# EAGLE schematic BLL-EBOOK (EAGLE 9.6.2)
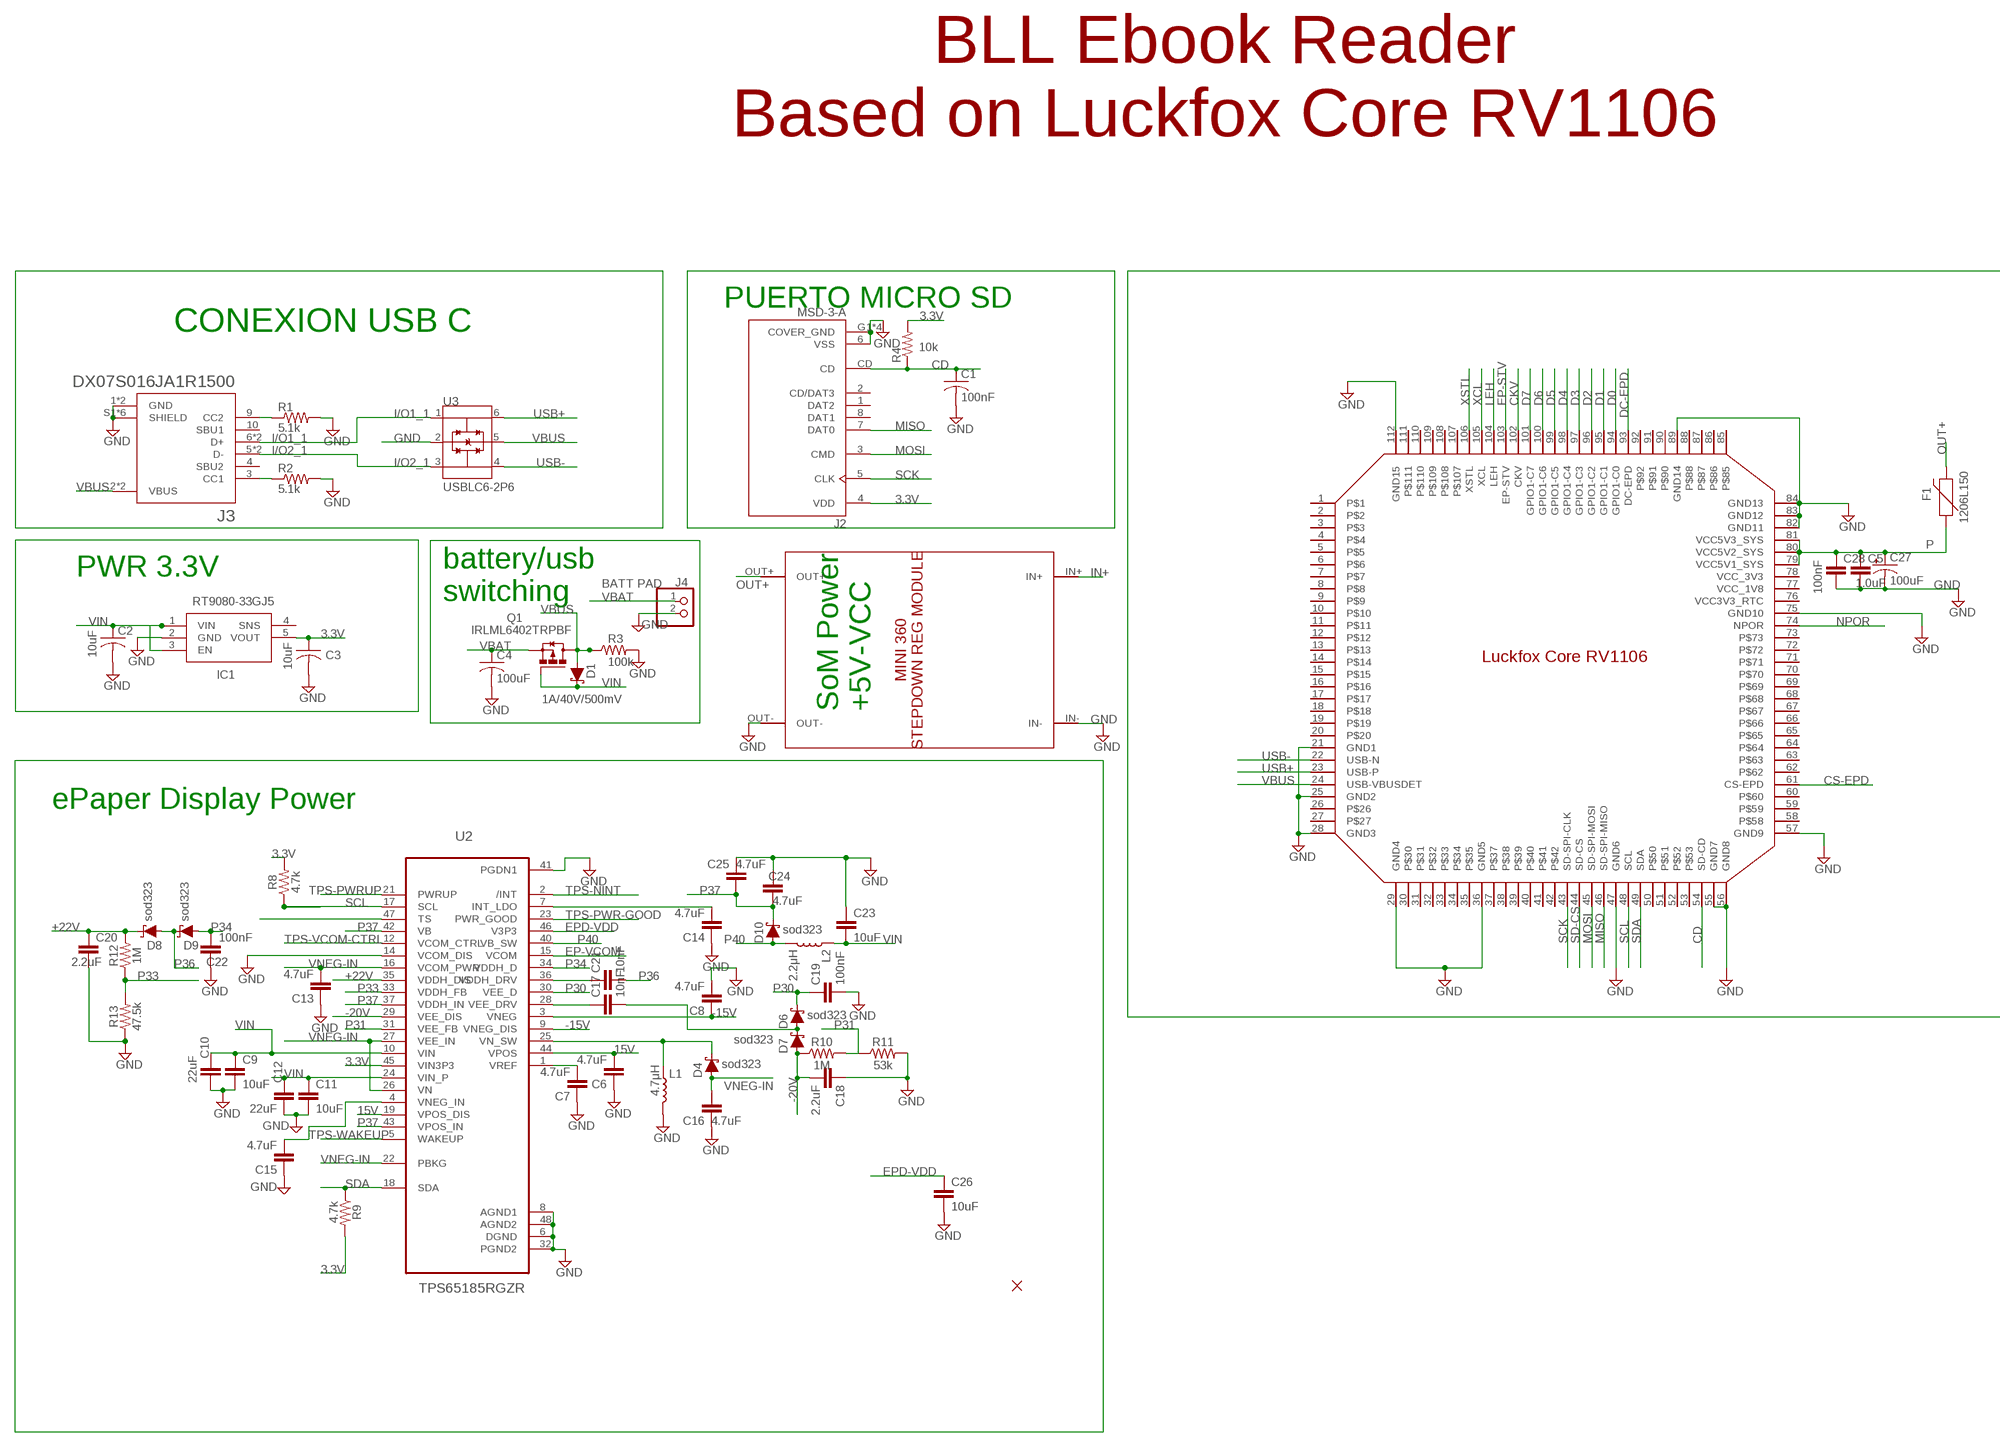
[diagram p0: schematic, sheet 1, part 1 of 2]
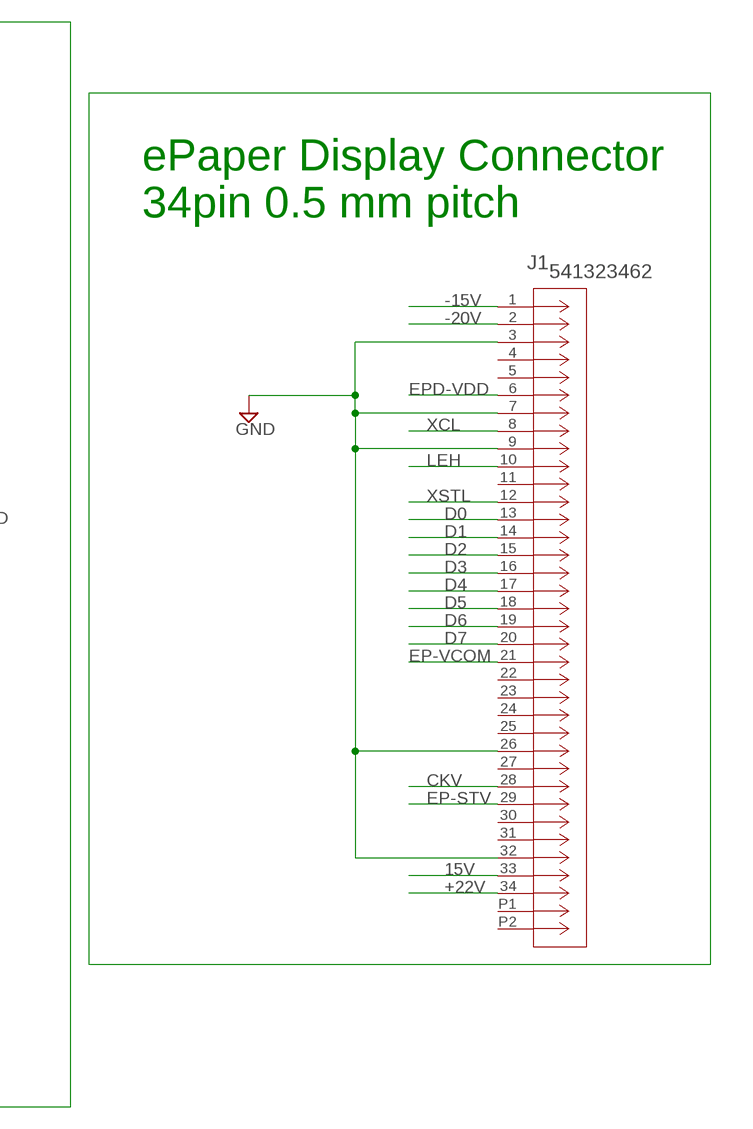
[diagram p1: schematic, sheet 1, part 2 of 2]

## Parts
C1  100nF  C-USC0603  [C0603]
C2  10uF  C-USC0603  [C0603]
C3  10uF  C-USC0603  [C0603]
C4  100uF  C-USC0603  [C0603]
C5  1.0uF  1.0UF-0603-16V-10%-X7R  [0603]
C6  4.7uF  4.7UF-0603-35V-(20%)  [0603]
C7  4.7uF  4.7UF-0603-35V-(20%)  [0603]
C8  4.7uF  4.7UF-0603-35V-(20%)  [0603]
C9  10uF  10UF-0805-10V-10%  [0805]
C10  22uF  22UF-0805-16V-20%  [0805]
C11  10uF  10UF-0805-10V-10%  [0805]
C12  22uF  22UF-0805-16V-20%  [0805]
C13  4.7uF  4.7UF-0603-35V-(20%)  [0603]
C14  4.7uF  4.7UF-0603-35V-(20%)  [0603]
C15  4.7uF  4.7UF-0603-35V-(20%)  [0603]
C16  4.7uF  4.7UF-0603-35V-(20%)  [0603]
C17  10nF  10NF-0603-50V-10%  [0603]
C18  2.2uF  2.2UF-1206-50V-10%  [1206]
C19  100nF  DNP-0603  [0603]
C20  2.2uF  2.2UF-1206-50V-10%  [1206]
C21  10nF  10NF-0603-50V-10%  [0603]
C22  100nF  DNP-0603  [0603]
C23  10uF  10UF-0805-10V-10%  [0805]
C24  4.7uF  4.7UF-0603-35V-(20%)  [0603]
C25  4.7uF  4.7UF-0603-35V-(20%)  [0603]
C26  10uF  10UF-0805-10V-10%  [0805]
C27  100uF  100UF-POLAR-EIA3528-10V-20%(TANT)  [EIA3528]
C28  100nF  CAP-0805  [0805]
D1  1A/40V/500mV  DIODE-SCHOTTKY-SS14  [SMA-DIODE]
D4  sod323  DIODE-SCHOTTKY-PMEG4005EJ  [SOD-323]
D6  sod323  DIODE-SCHOTTKY-PMEG4005EJ  [SOD-323]
D7  sod323  DIODE-SCHOTTKY-PMEG4005EJ  [SOD-323]
D8  sod323  DIODE-SCHOTTKY-PMEG4005EJ  [SOD-323]
D9  sod323  DIODE-SCHOTTKY-PMEG4005EJ  [SOD-323]
D10  sod323  DIODE-SCHOTTKY-PMEG4005EJ  [SOD-323]
F1  1206L150  PPTC_6V500MA-2  [1206]
IC1  RT9080-33GJ5  [SOT94P280X100-5N]
J1  541323462  [CON_541323462_MOL]
J2  MSD-3-A  [CUI_MSD-3-A]
J3  DX07S016JA1R1500  [JAE_DX07S016JA1R1500]
J4  BATT PAD  PINHD-1X2/90  [1X02/90]
L1  4.7μH  4.7μH_SHIELDED_INDUCTOR  [1008(2520)]
L2  2.2μH  2.2μH_SHIELDED_INDUCTOR  [0806]
Q1  IRLML6402TRPBF  [SOT23]
R1  5.1k  R-US_M0805  [M0805]
R2  5.1k  R-US_M0805  [M0805]
R3  100k  R-US_R0603  [R0603]
R4  10k  R-US_M0805  [M0805]
R8  4.7k  4.7KOHM-0603-1/10W-1%  [0603]
R9  4.7k  4.7KOHM-0603-1/10W-1%  [0603]
R10  1M  1MOHM-0603-1/4W-5%  [0603]
R11  53k  RESISTOR0805  [0805]
R12  1M  1MOHM-0603-1/4W-5%  [0603]
R13  47.5k  RESISTOR0805  [0805]
U2  TPS65185RGZR  [QFN50P700X700X100-49N]
U3  USBLC6-2P6  [SOT50P160X60-6N]
U$1  LUCKFOX_CORE_RV1106  [CORE1106-SMT]
U$2  MINI360-MOD-REG  [MINI360]

## Nets
3.3V: C3.1 IC1.5(VOUT) J2.4(VDD) R4.2 R8.2 R9.2 U2.45(VIN3P3)
15V: C6.2 J1.33 U2.19(VPOS_DIS) U2.44(VPOS)
+22V: C20.1 D8.C J1.34 R12.2 U2.35(VDDH_DIS)
-15V: C8.1 J1.1 U2.3(VNEG) U2.9(VNEG_DIS)
-20V: C18.2 D7.A J1.2 R10.1 U2.29(VEE_DIS)
CD: C1.1 J2.CD R4.1 U$1.54(SD-CD)
CKV: J1.28 U$1.102(CKV)
CS-EPD: U$1.61(CS-EPD)
D0: J1.13 U$1.94(GPIO1-C0)
D1: J1.14 U$1.95(GPIO1-C1)
D2: J1.15 U$1.96(GPIO1-C2)
D3: J1.16 U$1.97(GPIO1-C3)
D4: J1.17 U$1.98(GPIO1-C4)
D5: J1.18 U$1.99(GPIO1-C5)
D6: J1.19 U$1.100(GPIO1-C6)
D7: J1.20 U$1.101(GPIO1-C7)
DC-EPD: U$1.93(DC-EPD)
EP-STV: J1.29 U$1.103(EP-STV)
EP-VCOM: J1.21 U2.15(VCOM)
EPD-VDD: C26.1 J1.6 U2.46(V3P3)
GND: C1.2 C2.2 C3.2 C4.2 C5.2 C6.1 C7.1 C8.2 C9.2 C10.2 C11.2 C12.2 C13.1 C14.1 C15.1 C16.1 C18.1 C19.2 C20.2 C22.1 C23.1 C24.2 C25.2 C26.2 C27.C(-) C28.2 IC1.2(GND) J1.3 J1.7 J1.9 J1.26 J1.32 J2.6(VSS) J2.G1(COVER_GND) J2.G2(COVER_GND) J2.G3(COVER_GND) J2.G4(COVER_GND) J3.1(GND) J3.12(GND) J3.S1(SHIELD) J3.S2(SHIELD) J3.S3(SHIELD) J3.S4(SHIELD) J3.S5(SHIELD) J3.S6(SHIELD) J4.2 L1.2 R1.2 R2.2 R3.2 R11.2 R13.1 U2.6(DGND) U2.8(AGND1) U2.14(VCOM_DIS) U2.32(PGND2) U2.41(PGDN1) U2.48(AGND2) U3.2(GND) U$1.21(GND1) U$1.25(GND2) U$1.28(GND3) U$1.29(GND4) U$1.36(GND5) U$1.47(GND6) U$1.55(GND7) U$1.56(GND8) U$1.57(GND9) U$1.75(GND10) U$1.82(GND11) U$1.83(GND12) U$1.84(GND13) U$1.89(GND14) U$1.112(GND15) U$2.IN- U$2.OUT-
I/O1_1: J3.6(D+) J3.7(D+) U3.1(I/O1_1)
I/O2_1: J3.5(D-) J3.8(D-) U3.3(I/O2_1)
IN+: U$2.IN+
LEH: J1.10 U$1.104(LEH)
MISO: J2.7(DAT0) U$1.46(SD-SPI-MISO)
MOSI: J2.3(CMD) U$1.45(SD-SPI-MOSI)
N$3: J3.3(CC1) R2.1
N$4: J3.9(CC2) R1.1
N$11: U2.47(TS)
N$12: C7.2 U2.1(VREF)
N$13: C15.2 U2.4(VNEG_IN)
N$14: C14.2 U2.7(INT_LDO)
N$15: D4.C L1.1 U2.25(VN_SW)
N$16: C17.1 U2.28(VEE_DRV)
N$17: C17.2 D6.A D7.C
N$19: C21.1 U2.36(VDDH_DRV)
NPOR: U$1.74(NPOR)
OUT+: F1.2 U$2.OUT+
P: C5.1 C27.A(+) C28.1 F1.1 U$1.79(VCC5V1_SYS) U$1.80(VCC5V2_SYS) U$1.81(VCC5V3_SYS)
P30: C19.1 D6.C U2.30(VEE_D)
P31: R10.2 R11.1 U2.31(VEE_FB)
P33: R12.1 R13.2 U2.33(VDDH_FB)
P34: C22.2 D9.A U2.34(VDDH_D)
P36: C21.2 D8.A D9.C
P37: C24.1 C25.1 D10.C U2.37(VDDH_IN) U2.42(VB) U2.43(VPOS_IN)
P40: D10.A L2.2 U2.40(VB_SW)
SCK: J2.5(CLK) U$1.43(SD-SPI-CLK)
SCL: R8.1 U2.17(SCL) U$1.48(SCL)
SD-CS: U$1.44(SD-CS)
SDA: R9.1 U2.18(SDA) U$1.49(SDA)
TPS-NINT: U2.2(/INT)
TPS-PWR-GOOD: U2.23(PWR_GOOD)
TPS-PWRUP: U2.21(PWRUP)
TPS-VCOM-CTRL: U2.12(VCOM_CTRL)
TPS-WAKEUP: U2.5(WAKEUP)
USB+: U3.6(I/O1_2) U$1.23(USB-P)
USB-: U3.4(I/O2_2) U$1.22(USB-N)
VBAT: C4.1 J4.1 Q1.2(S)
VBUS: D1.A J3.2(VBUS) J3.11(VBUS) Q1.3(D) R3.1 U3.5(VBUS) U$1.24(USB-VBUSDET)
VIN: C2.1 C9.1 C10.1 C11.1 C12.1 C23.2 D1.C IC1.1(VIN) IC1.3(EN) L2.1 Q1.1(G) U2.10(VIN) U2.24(VIN_P)
VNEG-IN: C13.2 C16.2 D4.A U2.16(VCOM_PWR) U2.22(PBKG) U2.26(VN) U2.27(VEE_IN)
XCL: J1.8 U$1.105(XCL)
XSTL: J1.12 U$1.106(XSTL)
Unconnected: IC1.4(SNS) J1.4 J1.5 J1.11 J1.22 J1.23 J1.24 J1.25 J1.27 J1.30 J1.31 J1.P1 J1.P2 J2.1(DAT2) J2.2(CD/DAT3) J2.8(DAT1) J3.4(SBU2) J3.10(SBU1) U$1.1 U$1.2 U$1.3 U$1.4 U$1.5 U$1.6 U$1.7 U$1.8 U$1.9 U$1.10 U$1.11 U$1.12 U$1.13 U$1.14 U$1.15 U$1.16 U$1.17 U$1.18 U$1.19 U$1.20 U$1.26 U$1.27 U$1.30 U$1.31 U$1.32 U$1.33 U$1.34 U$1.35 U$1.37 U$1.38 U$1.39 U$1.40 U$1.41 U$1.42 U$1.50 U$1.51 U$1.52 U$1.53 U$1.58 U$1.59 U$1.60 U$1.62 U$1.63 U$1.64 U$1.65 U$1.66 U$1.67 U$1.68 U$1.69 U$1.70 U$1.71 U$1.72 U$1.73 U$1.77(VCC_1V8) U$1.78(VCC_3V3) U$1.85 U$1.86 U$1.87 U$1.88 U$1.90 U$1.91 U$1.92 U$1.107 U$1.108 U$1.109 U$1.110 U$1.111

## Notes on the sheet
- BLL Ebook Reader
  Based on Luckfox Core RV1106
- PUERTO MICRO SD
- CONEXION USB C
- ePaper Display Connector
  34pin 0.5 mm pitch
- PWR 3.3V
- battery/usb 
  switching
- SoM Power
  +5V-VCC
- ePaper Display Power

## Power pins joined to a net without a drawn wire
VCC3V3_RTC: U$1.76(VCC3V3_RTC)

## Library data of the parts
C1-C4 = rcl:C-US: CAPACITOR, American symbol; SPICEPREFIX: C
C5 = SparkFun-Capacitors:1.0UF: 1µF ceramic capacitors A capacitor is a passive two-terminal electrical component used to store electrical energy temporarily in an electric field.; PROD_ID: CAP-13930
C6-C8 C13-C16 C24 C25 = SparkFun-Capacitors:4.7UF: 4.7µF ceramic capacitors A capacitor is a passive two-terminal electrical component used to store electrical energy temporarily in an electric field.; PROD_ID: CAP-14106
C9 C11 C23 C26 = SparkFun-Capacitors:10UF: 10.0µF ceramic capacitors A capacitor is a passive two-terminal electrical component used to store electrical energy temporarily in an electric field.; PROD_ID: CAP-11330
C10 C12 = SparkFun-Capacitors:22UF: 22µF ceramic capacitors A capacitor is a passive two-terminal electrical component used to store electrical energy temporarily in an electric field.; PROD_ID: CAP-14260
C17 C21 = SparkFun-Capacitors:10NF: 0.01uF/10nF/10,000pF ceramic capacitors A capacitor is a passive two-terminal electrical component used to store electrical energy temporarily in an electric field. CAP-09321; PROD_ID: CAP-00867
C18 C20 = SparkFun-Capacitors:2.2UF: 2.2µF ceramic capacitors A capacitor is a passive two-terminal electrical component used to store electrical energy temporarily in an electric field.; PROD_ID: CAP-10009
C19 C22 = SparkFun-Capacitors:DNP: Do-Not-Populate capacitor; VALUE: DNP
C27 = SparkFun-Capacitors:100UF-POLAR: 100µF polarized capacitors A capacitor is a passive two-terminal electrical component used to store electrical energy temporarily in an electric field.; PROD_ID: CAP-16823
C28 = SparkFun-Capacitors:CAP
D1 = SparkFun-DiscreteSemi:DIODE-SCHOTTKY: Schottky diode A Schottky diode is a semiconductor diode which has a low forward voltage drop and a very fast switching action.; PROD_ID: DIO-08053
D4 D6-D10 = SparkFun-DiscreteSemi:DIODE-SCHOTTKY: Schottky diode A Schottky diode is a semiconductor diode which has a low forward voltage drop and a very fast switching action.; PROD_ID: DIO-10955; VALUE: 0.5A/40V/420mV
F1 = SparkFun-Fuses:PPTC: Resettable Fuse PPTC Resettable Fuse. Really a sort of resistor with a polymeric positive temperature coefficient whose resistance increases dramatically with an increase in temperature. When heated by the power passing through the resistance rises causing the current to be limited, protecting the circuit. This is achieved by the transition of the polymer from a crystalline to an amorphous state where the conductive carbon separates breaking the conductive pathways found in the cool crystalline structure. When a PPTC cools back down it resumes conducting letting the circuit turn back on. SparkFun Products: SparkFun RedBoard - Programmed with Arduino <https://www.sparkfun.com/products/12757> Pro Micro - 5V/16MHz <https://www.sparkfun.com/products/12640> Arduino Pro 328 - 5V/16MHz <https://www.sparkfun.com/products/10915> MP3 Trigger <https://www.sparkfun.com/products/13720>; PROD_ID: RES-08585; VALUE: 6V/0.5A
IC1 = RT9080-33GJ5:RT9080-33GJ5: Check availability <https://pricing.snapeda.com/parts/RT9080-33GJ5/Richtek%20USA/view-part?ref=eda>; AVAILABILITY: In Stock; CHECK_PRICES: https://www.snapeda.com/parts/RT9080-33GJ5/Richtek/view-part/?ref=eda; DESCRIPTION: Linear Voltage Regulator IC Positive Fixed 1 Output 600mA TSOT-23-5; MF: Richtek USA; MP: RT9080-33GJ5; PACKAGE: TSOT-23 Richtek; PRICE: None; SNAPEDA_LINK: https://www.snapeda.com/parts/RT9080-33GJ5/Richtek/view-part/?ref=snap
J1 = molex fpc 34p 0.5mm :541323462: Check availability <https://pricing.snapeda.com/parts/541323462/Molex/view-part?ref=eda>; AVAILABILITY: In Stock; CHECK_PRICES: https://www.snapeda.com/parts/541323462/Molex/view-part/?ref=eda; DESCRIPTION: 34 Position FFC, FPC Connector Contacts, Bottom 0.020 (0.50mm) Surface Mount, Right Angle; MF: Molex; MP: 541323462; PACKAGE: None; PRICE: None; SNAPEDA_LINK: https://www.snapeda.com/parts/541323462/Molex/view-part/?ref=snap
J2 = MSD-3-A:MSD-3-A: Check availability <https://pricing.snapeda.com/parts/MSD-3-A/Same%20Sky/view-part?ref=eda>; AVAILABILITY: In Stock; CHECK_PRICES: https://www.snapeda.com/parts/MSD-3-A/Same+Sky/view-part/?ref=eda; DESCRIPTION: Micro SD Card Connector, 9 Positions, Connector and Ejector, Push In, Auto Eject Out, Surface Mount, 0.95 mm Height Above Board, Gold Flash; MF: Same Sky; MP: MSD-3-A; PACKAGE: None; PRICE: None; SNAPEDA_LINK: https://www.snapeda.com/parts/MSD-3-A/Same+Sky/view-part/?ref=snap
J3 = DX07S016JA1R1500- usb c:DX07S016JA1R1500: Check availability <https://pricing.snapeda.com/parts/DX07S016JA1R1500/JAE%20Electronics/view-part?ref=eda>; AVAILABILITY: In Stock; CHECK_PRICES: https://www.snapeda.com/parts/DX07S016JA1R1500/JAE+Electronics/view-part/?ref=eda; DESCRIPTION: USB-C (USB TYPE-C) USB 2.0 Receptacle Connector 24 (16+8 Dummy) Position Surface Mount, Right Angle; Through Hole; MF: JAE Electronics; MP: DX07S016JA1R1500; PACKAGE: None; PRICE: None; SNAPEDA_LINK: https://www.snapeda.com/parts/DX07S016JA1R1500/JAE+Electronics/view-part/?ref=snap
J4 = pinhead:PINHD-1X2: PIN HEADER
L1 = SparkFun-Coils:4.7μH_SHIELDED_INDUCTOR: 4.7uH Inductor 4.7uH 1.4A 50mOhm 1008(2520) Package Shielded; PROD_ID: NDUC-14880
L2 = SparkFun-Coils:2.2μH_SHIELDED_INDUCTOR: Murata 2.2uH Inductor 2.2uH 1.2A 110mOhm 0806 Package Shielded Bourns 2.2uH Inductor 2.2uH 5.5A 205mOhm 5x5mm Package Shielded; PROD_ID: NDUC-14257
Q1 = IRLML6402:IRLML6402: Check availability <https://pricing.snapeda.com/parts/IRLML6402/Infineon%20Technologies/view-part?ref=eda>; AVAILABILITY: In Stock; CHECK_PRICES: https://www.snapeda.com/parts/IRLML6402/Infineon/view-part/?ref=eda; DESCRIPTION: P-Channel 20 V 3.7A (Ta) 1.3W (Ta) Surface Mount Micro3â„¢ /SOT-23; MF: Infineon Technologies; MP: IRLML6402; PACKAGE: SOT-23-3 ON Semiconductor; PRICE: None; SNAPEDA_LINK: https://www.snapeda.com/parts/IRLML6402/Infineon/view-part/?ref=snap
R1-R4 = rcl:R-US_: RESISTOR, American symbol; SPICEPREFIX: R
R8 R9 = SparkFun-Resistors:4.7KOHM: 4.7kΩ resistor A resistor is a passive two-terminal electrical component that implements electrical resistance as a circuit element. Resistors act to reduce current flow, and, at the same time, act to lower voltage levels within circuits. - Wikipedia; PROD_ID: RES-07857
R10 R12 = SparkFun-Resistors:1MOHM: 1MΩ resistor A resistor is a passive two-terminal electrical component that implements electrical resistance as a circuit element. Resistors act to reduce current flow, and, at the same time, act to lower voltage levels within circuits. - Wikipedia; PROD_ID: RES-07868
R11 R13 = SparkFun-Resistors:RESISTOR: Generic Resistor Package
U2 = TPS65185RGZR:TPS65185RGZR: Check availability <https://pricing.snapeda.com/parts/TPS65185RGZR/Texas%20Instruments/view-part?ref=eda>; AVAILABILITY: In Stock; CHECK_PRICES: https://www.snapeda.com/parts/TPS65185RGZR/Texas+Instruments/view-part/?ref=eda; DESCRIPTION: PMIC for E-Ink® Vizplex™ Enabled Electronic Paper Display w/ Active Discharge; MF: Texas Instruments; MP: TPS65185RGZR; PACKAGE: VQFN-48 Texas Instruments; PRICE: None; SNAPEDA_LINK: https://www.snapeda.com/parts/TPS65185RGZR/Texas+Instruments/view-part/?ref=snap
U3 = USBLC6-2P6:USBLC6-2P6: Check availability <https://pricing.snapeda.com/parts/USBLC6-2P6/STMicroelectronics/view-part?ref=eda>; AVAILABILITY: In Stock; CHECK_PRICES: https://www.snapeda.com/parts/USBLC6-2P6/STMicroelectronics/view-part/?ref=eda; DESCRIPTION: 17V Clamp 5A (8/20µs) Ipp Tvs Diode Surface Mount SOT-666; MF: STMicroelectronics; MP: USBLC6-2P6; PACKAGE: SOT-666 STMicroelectronics; PRICE: None; SNAPEDA_LINK: https://www.snapeda.com/parts/USBLC6-2P6/STMicroelectronics/view-part/?ref=snap
U$1 = Core1106-SMT-full:LUCKFOX_CORE_RV1106: The Core1106 is a core board based on the Rockchip RV1106 series chips, featuring high performance and high expandability, provides a convenient platform for developers to design their own hardware, enabling quick design verification or direct integration into products, thereby shortening the R&D cycle. Adapting various interfaces via castellated holes, such as MIPI CSI, RGB LCD, GPIO, UART, SPI, I2C, USB, Ethernet port, and SDIO, etc. which is suitable for a variety of application scenarios. Optional for wireless module, with two core options of RV1106G2 and RV1106G3 to meet different needs. Specs: Connectivity Bluetooth Bluetooth 5.2/BLE (optional) Ethernet 10/100M Wi-Fi 2.4 GHz WIFI 6 (optional) Memory and Storage eMMC 8GB Memory 128MB/256MB SOC Features ISP 5MP@30fps NPU 0.5TOPS/1TOPS Processor Cortex A7 @1.2GHz Video Encoding Hardware encoding, supports MJPEG, H264, H265 Interfaces & Peripherals Audio Ouput LINEOUT × 1 Camera Interface MIPI CSI 2-lane × 2, MIPI CSI 4-lane × 1 Display Interface Parallel RGB 18-bit × 1 GPIO 112 Pin USB USB 2.0 Host/Device Others Operating Temp. -10°C ~ 80°C Power input 5V DC; DESCRIPTION: Core1106 is a core board based on the Rockchip RV1106 series chips, it features a 128MB-256MB DDR3 RAM, on board Wifi & and BLE, onboard 8GB eMMC Storage, and a rich GPIO pins for expandability.; DOCUMENTATION: visit the Luckfox core Wiki: http://https://wiki.luckfox.com/Core1106/ for more resources for this board.; MF: Luckfox Systems; MP: LuckFox Core1106; PACKAGE: as a high integrated module, it comes in a SoM, 112 pins with 1 ml spacing castellated holes.
U$2 = MINI360 MOD REGULATOR:MINI360-MOD-REG